# EAGLE design stm32103c8t6-v3 (EAGLE 7.3.0)
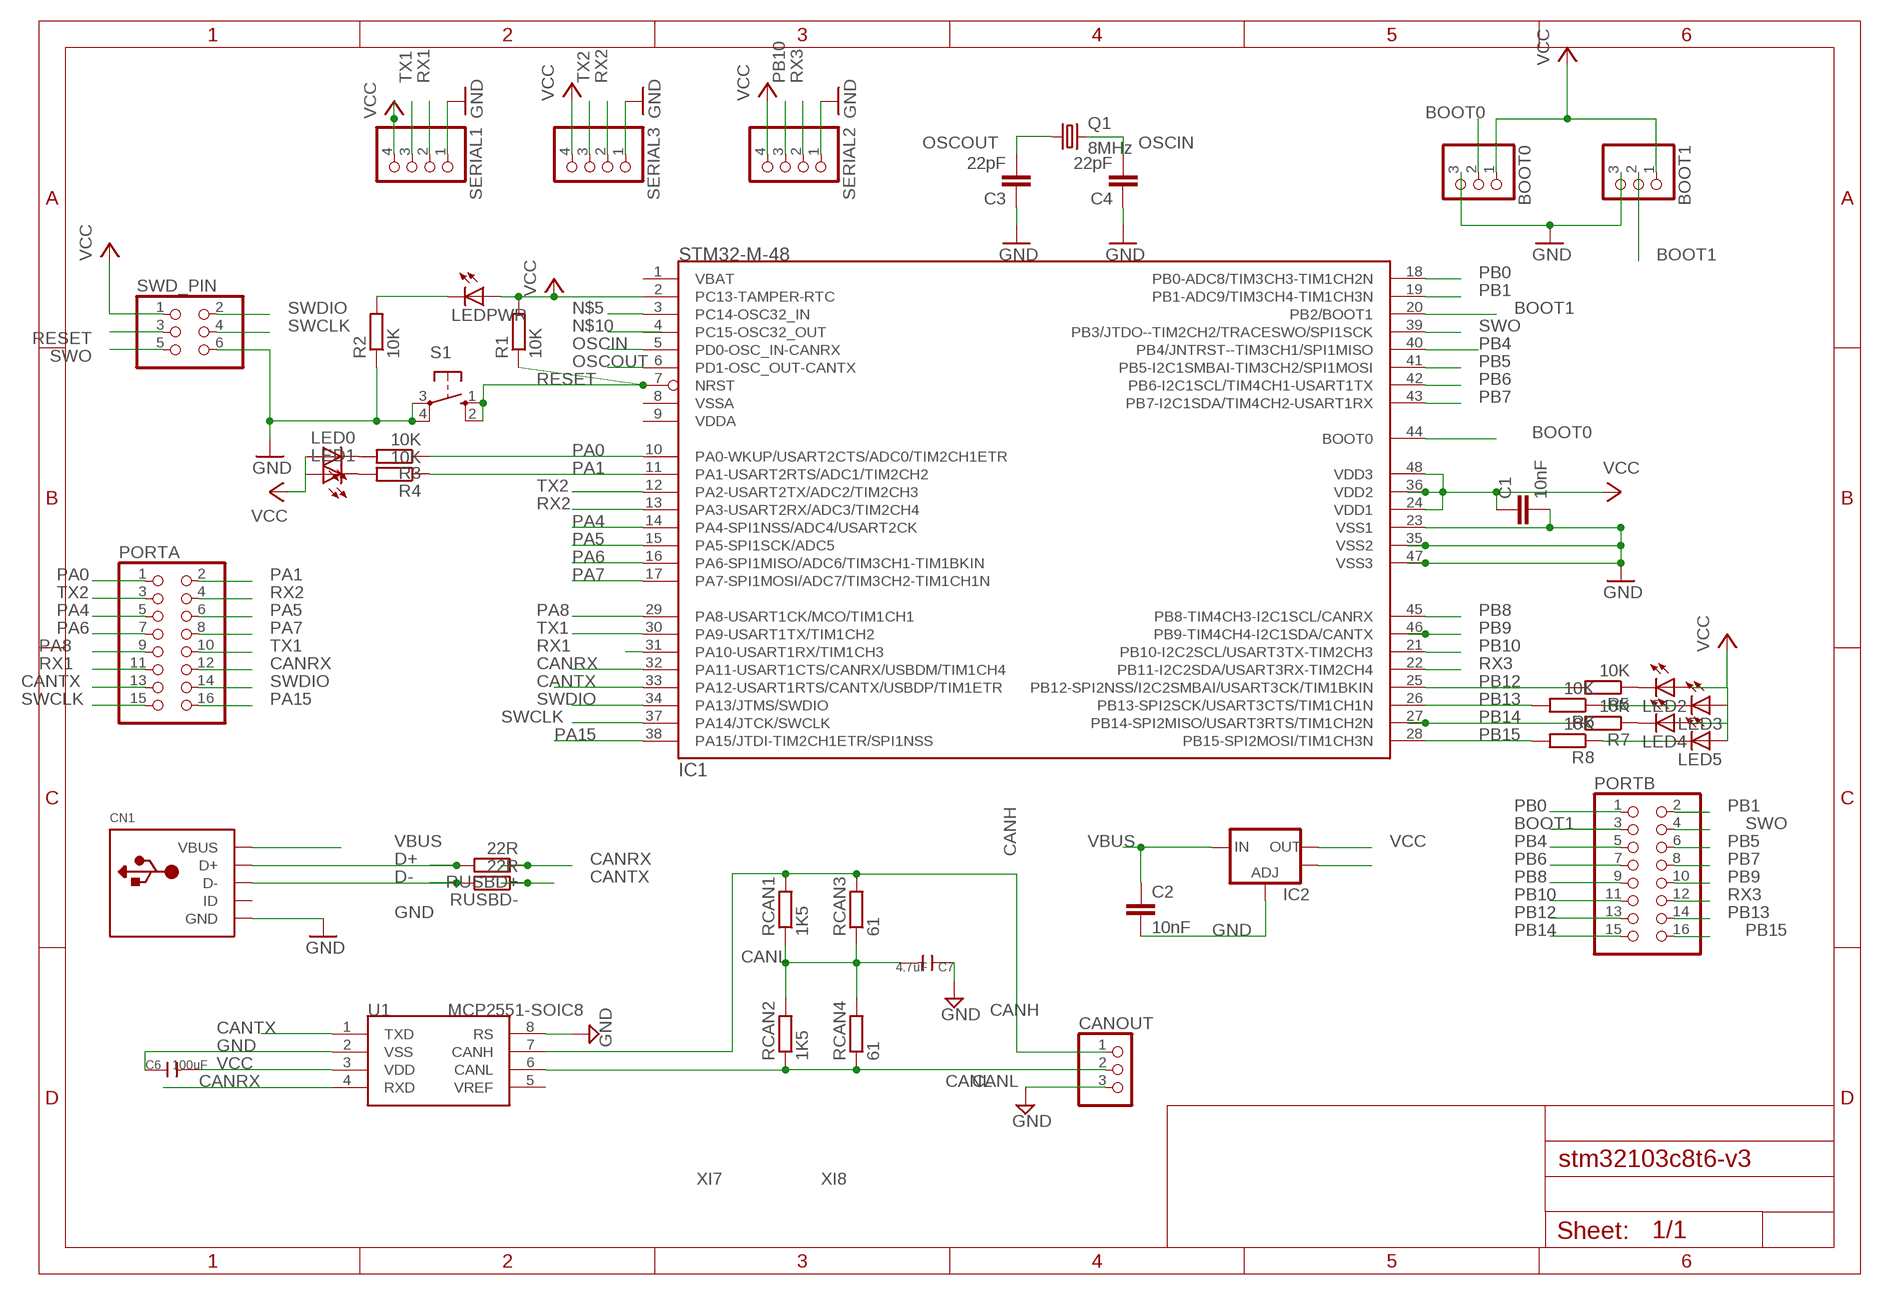
[diagram p0: schematic, sheet 1]

## Parts
BOOT0  PINHD-1X3  [1X03]
BOOT1  PINHD-1X3  [1X03]
C1  10nF  C-EUC1210  [C1210]
C2  10nF  C-EUC1206  [C1206]
C3  22pF  C-EUC1210  [C1210]
C4  22pF  C-EUC1210  [C1210]
C6  100uF  C-1206  [C1206]
C7  4.7uF  C-1206  [C1206]
CANOUT  PINHD-1X3  [1X03]
CN1  USBTHM  [USB-MINIB-THM]
IC1  STM32-M-48  [LQFP48]
IC2  V_REG_LM1117SOT223  [SOT223]
LED0  LEDSMT1206  [1206]
LED1  LEDSMT1206  [1206]
LED2  LEDSMT1206  [1206]
LED3  LEDSMT1206  [1206]
LED4  LEDSMT1206  [1206]
LED5  LEDSMT1206  [1206]
LEDPWR  LEDSMT1206  [1206]
PORTA  PINHD-2X8  [2X08]
PORTB  PINHD-2X8  [2X08]
Q1  8MHz  CRYSTALHC49S  [HC49/S]
R1  10K  R-EU_R1206  [R1206]
R2  10K  R-EU_R1206  [R1206]
R3  10K  R-EU_R1206  [R1206]
R4  10K  R-EU_R1206  [R1206]
R5  10K  R-EU_R1206  [R1206]
R6  10K  R-EU_R1206  [R1206]
R7  10K  R-EU_R1206  [R1206]
R8  10K  R-EU_R1206  [R1206]
RCAN1  1K5  R-EU_R1206  [R1206]
RCAN2  1K5  R-EU_R1206  [R1206]
RCAN3  61  R-EU_R1206  [R1206]
RCAN4  61  R-EU_R1206  [R1206]
RUSBD+  22R  R-EU_R1206  [R1206]
RUSBD-  22R  R-EU_R1206  [R1206]
S1  10-XX  [B3F-10XX]
SERIAL1  PINHD-1X4  [1X04]
SERIAL2  PINHD-1X4  [1X04]
SERIAL3  PINHD-1X4  [1X04]
SWD_PIN  PINHD-2X3  [2X03]
U1  MCP2551-SOIC8  [SOIC8-6.0]

## Nets
BOOT0: BOOT0.2 IC1.44(BOOT0)
BOOT1: BOOT1.2 IC1.20(PB2/BOOT1) PORTB.3
CANH [CAN]: CANOUT.1 RCAN1.2 RCAN3.2 U1.7(CANH)
CANL [CAN]: CANOUT.2 RCAN2.1 RCAN4.1 U1.6(CANL)
CANRX: IC1.32(PA11-USART1CTS/CANRX/USBDM/TIM1CH4) PORTA.12 RUSBD+.1 U1.4(RXD)
CANTX: IC1.33(PA12-USART1RTS/CANTX/USBDP/TIM1ETR) PORTA.13 RUSBD-.1 U1.1(TXD)
D+: CN1.D+ RUSBD+.2
D-: CN1.D- RUSBD-.2
GND [GND]: BOOT0.3 BOOT1.3 C1.2 C2.2 C3.1 C4.1 C6.1 C7.1 CANOUT.3 CN1.GND IC1.23(VSS1) IC1.35(VSS2) IC1.47(VSS3) IC2.1(ADJ) R2.1 S1.3(P) S1.4(P1) SERIAL1.1 SERIAL2.1 SERIAL3.1 SWD_PIN.6 U1.2(VSS) U1.8(RS)
N$1: IC2.4(OUT)
N$2: LED0.C R3.2
N$3: LED1.C R4.2
N$4: LEDPWR.C R2.2
N$5: IC1.3(PC14-OSC32_IN)
N$6: LED2.C R5.1
N$7: LED3.C R6.1
N$8: LED4.C R7.1
N$9: LED5.C R8.1
OSCIN: C4.2 IC1.5(PD0-OSC_IN-CANRX) Q1.2
OSCOUT: C3.2 IC1.6(PD1-OSC_OUT-CANTX) Q1.1
PA0: IC1.10(PA0-WKUP/USART2CTS/ADC0/TIM2CH1ETR) PORTA.1 R3.1
PA1: IC1.11(PA1-USART2RTS/ADC1/TIM2CH2) PORTA.2 R4.1
PA4: IC1.14(PA4-SPI1NSS/ADC4/USART2CK) PORTA.5
PA5: IC1.15(PA5-SPI1SCK/ADC5) PORTA.6
PA6: IC1.16(PA6-SPI1MISO/ADC6/TIM3CH1-TIM1BKIN) PORTA.7
PA7: IC1.17(PA7-SPI1MOSI/ADC7/TIM3CH2-TIM1CH1N) PORTA.8
PA8: IC1.29(PA8-USART1CK/MCO/TIM1CH1) PORTA.9
PA15: IC1.38(PA15/JTDI-TIM2CH1ETR/SPI1NSS) PORTA.16
PB0: IC1.18(PB0-ADC8/TIM3CH3-TIM1CH2N) PORTB.1
PB1: IC1.19(PB1-ADC9/TIM3CH4-TIM1CH3N) PORTB.2
PB4: IC1.40(PB4/JNTRST--TIM3CH1/SPI1MISO) PORTB.5
PB5: IC1.41(PB5-I2C1SMBAI-TIM3CH2/SPI1MOSI) PORTB.6
PB6: IC1.42(PB6-I2C1SCL/TIM4CH1-USART1TX) PORTB.7
PB7: IC1.43(PB7-I2C1SDA/TIM4CH2-USART1RX) PORTB.8
PB8: IC1.45(PB8-TIM4CH3-I2C1SCL/CANRX) PORTB.9
PB9: IC1.46(PB9-TIM4CH4-I2C1SDA/CANTX) PORTB.10
PB10: IC1.21(PB10-I2C2SCL/USART3TX-TIM2CH3) PORTB.11 SERIAL2.3
PB12: IC1.25(PB12-SPI2NSS/I2C2SMBAI/USART3CK/TIM1BKIN) PORTB.13 R5.2
PB13: IC1.26(PB13-SPI2SCK/USART3CTS/TIM1CH1N) PORTB.14 R6.2
PB14: IC1.27(PB14-SPI2MISO/USART3RTS/TIM1CH2N) PORTB.15 R7.2
PB15: IC1.28(PB15-SPI2MOSI/TIM1CH3N) PORTB.16 R8.2
RESET: IC1.7(NRST) R1.1 S1.1(S) S1.2(S1) SWD_PIN.3
RX1: IC1.31(PA10-USART1RX/TIM1CH3) PORTA.11 SERIAL1.2
RX2: IC1.13(PA3-USART2RX/ADC3/TIM2CH4) PORTA.4 SERIAL3.2
RX3: IC1.22(PB11-I2C2SDA/USART3RX-TIM2CH4) PORTB.12 SERIAL2.2
SWCLK: IC1.37(PA14/JTCK/SWCLK) PORTA.15 SWD_PIN.4
SWDIO: IC1.34(PA13/JTMS/SWDIO) PORTA.14 SWD_PIN.2
SWO: IC1.39(PB3/JTDO--TIM2CH2/TRACESWO/SPI1SCK) PORTB.4 SWD_PIN.5
TX1: IC1.30(PA9-USART1TX/TIM1CH2) PORTA.10 SERIAL1.3
TX2: IC1.12(PA2-USART2TX/ADC2/TIM2CH3) PORTA.3 SERIAL3.3
UNIC: C7.2 RCAN1.1 RCAN2.2 RCAN3.1 RCAN4.2
VBUS: C2.1 CN1.VBUS IC2.3(IN)
VCC [POWER]: BOOT0.1 BOOT1.1 C1.1 C6.2 IC1.2(PC13-TAMPER-RTC) IC1.24(VDD1) IC1.36(VDD2) IC1.48(VDD3) IC2.2(OUT) LED0.A LED1.A LED2.A LED3.A LED4.A LED5.A LEDPWR.A R1.2 SERIAL1.4 SERIAL2.4 SERIAL3.4 SWD_PIN.1 U1.3(VDD)
Unconnected: CN1.ID IC1.1(VBAT) IC1.4(PC15-OSC32_OUT) IC1.8(VSSA) IC1.9(VDDA) U1.5(VREF)

## Library data of the parts
BOOT0 BOOT1 CANOUT = pinhead:PINHD-1X3: PIN HEADER
C1-C4 = rcl:C-EU: CAPACITOR, European symbol
C6 C7 = Discrete:C*: Ceramic Capacitors
CN1 = adafruit:USB: USB Connectors USBMINIB - Surface Mount Female Mini-B USB Connector 4UConnector: 06564 By microbuilder.eu Thru-hole RA Female Mini-B USB Connector 4UConnector: 18732 By ladyada.net
IC1 = pel_stm32:STM32-M-48: STM32F103 Medium Density 48pins
IC2 = SparkFun-PowerIC:V_REG_LM1117: Voltage Regulator LM1117 Standard adjustable voltage regulator but in SMD form. Spark Fun Electronics SKU : COM-00595
LED0 LED1-LED5 LEDPWR = led:LED: LED OSRAM: - CHIPLED LG R971, LG N971, LY N971, LG Q971, LY Q971, LO R971, LY R971 LH N974, LH R974 LS Q976, LO Q976, LY Q976 LO Q996 - Hyper CHIPLED LW Q18S LB Q993, LB Q99A, LB R99A - SideLED LS A670, LO A670, LY A670, LG A670, LP A670 LB A673, LV A673, LT A673, LW A673 LH A674 LY A675 LS A676, LA A676, LO A676, LY A676, LW A676 LS A679, LY A679, LG A679 - Hyper Micro SIDELED® LS Y876, LA Y876, LO Y876, LY Y876 LT Y87S - SmartLED LW L88C, LW L88S LB L89C, LB L89S, LG L890 LS L89K, LO L89K, LY L89K LS L896, LA L896, LO L896, LY L896 - TOPLED LS T670, LO T670, LY T670, LG T670, LP T670 LSG T670, LSP T670, LSY T670, LOP T670, LYG T670 LG T671, LOG T671, LSG T671 LB T673, LV T673, LT T673, LW T673 LH T674 LS T676, LA T676, LO T676, LY T676, LB T676, LH T676, LSB T676, LW T676 LB T67C, LV T67C, LT T67C, LS T67K, LO T67K, LY T67K, LW E67C LS E67B, LA E67B, LO E67B, LY E67B, LB E67C, LV E67C, LT E67C LW T67C LS T679, LY T679, LG T679 LS T770, LO T770, LY T770, LG T770, LP T770 LB T773, LV T773, LT T773, LW T773 LH T774 LS E675, LA E675, LY E675, LS T675 LS T776, LA T776, LO T776, LY T776, LB T776 LHGB T686 LT T68C, LB T68C - Hyper Mini TOPLED® LB M676 - Mini TOPLED Santana® LG M470 LS M47K, LO M47K, LY M47K Source: http://www.osram.convergy.de LUXEON: - LUMILED® LXK2-PW12-R00, LXK2-PW12-S00, LXK2-PW14-U00, LXK2-PW14-V00 LXK2-PM12-R00, LXK2-PM12-S00, LXK2-PM14-U00 LXK2-PE12-Q00, LXK2-PE12-R00, LXK2-PE12-S00, LXK2-PE14-T00, LXK2-PE14-U00 LXK2-PB12-K00, LXK2-PB12-L00, LXK2-PB12-M00, LXK2-PB14-N00, LXK2-PB14-P00, LXK2-PB14-Q00 LXK2-PR12-L00, LXK2-PR12-M00, LXK2-PR14-Q00, LXK2-PR14-R00 LXK2-PD12-Q00, LXK2-PD12-R00, LXK2-PD12-S00 LXK2-PH12-R00, LXK2-PH12-S00 LXK2-PL12-P00, LXK2-PL12-Q00, LXK2-PL12-R00 Source: www.luxeon.com KINGBRIGHT: KA-3528ASYC Source: www.kingbright.com
PORTA PORTB = pinhead:PINHD-2X8: PIN HEADER
Q1 = crystal:CRYSTAL: CRYSTAL; OC_FARNELL: 1667008; OC_NEWARK: unknown
R1-R8 RCAN1-RCAN4 RUSBD+ RUSBD- = resistor:R-EU_: RESISTOR, European symbol
S1 = switch-omron:10-XX: OMRON SWITCH; MPN: B3F-1000; OC_FARNELL: 176432; OC_NEWARK: 36M3542
SERIAL1-SERIAL3 = pinhead:PINHD-1X4: PIN HEADER
SWD_PIN = pinhead:PINHD-2X3: PIN HEADER
U1 = IC:MCP2551: High-Speed CAN Transceiver http://ww1.microchip.com/downloads/en/devicedoc/21667f.pdf

## Net classes
3 CAN: width 0.356 mm

## Board
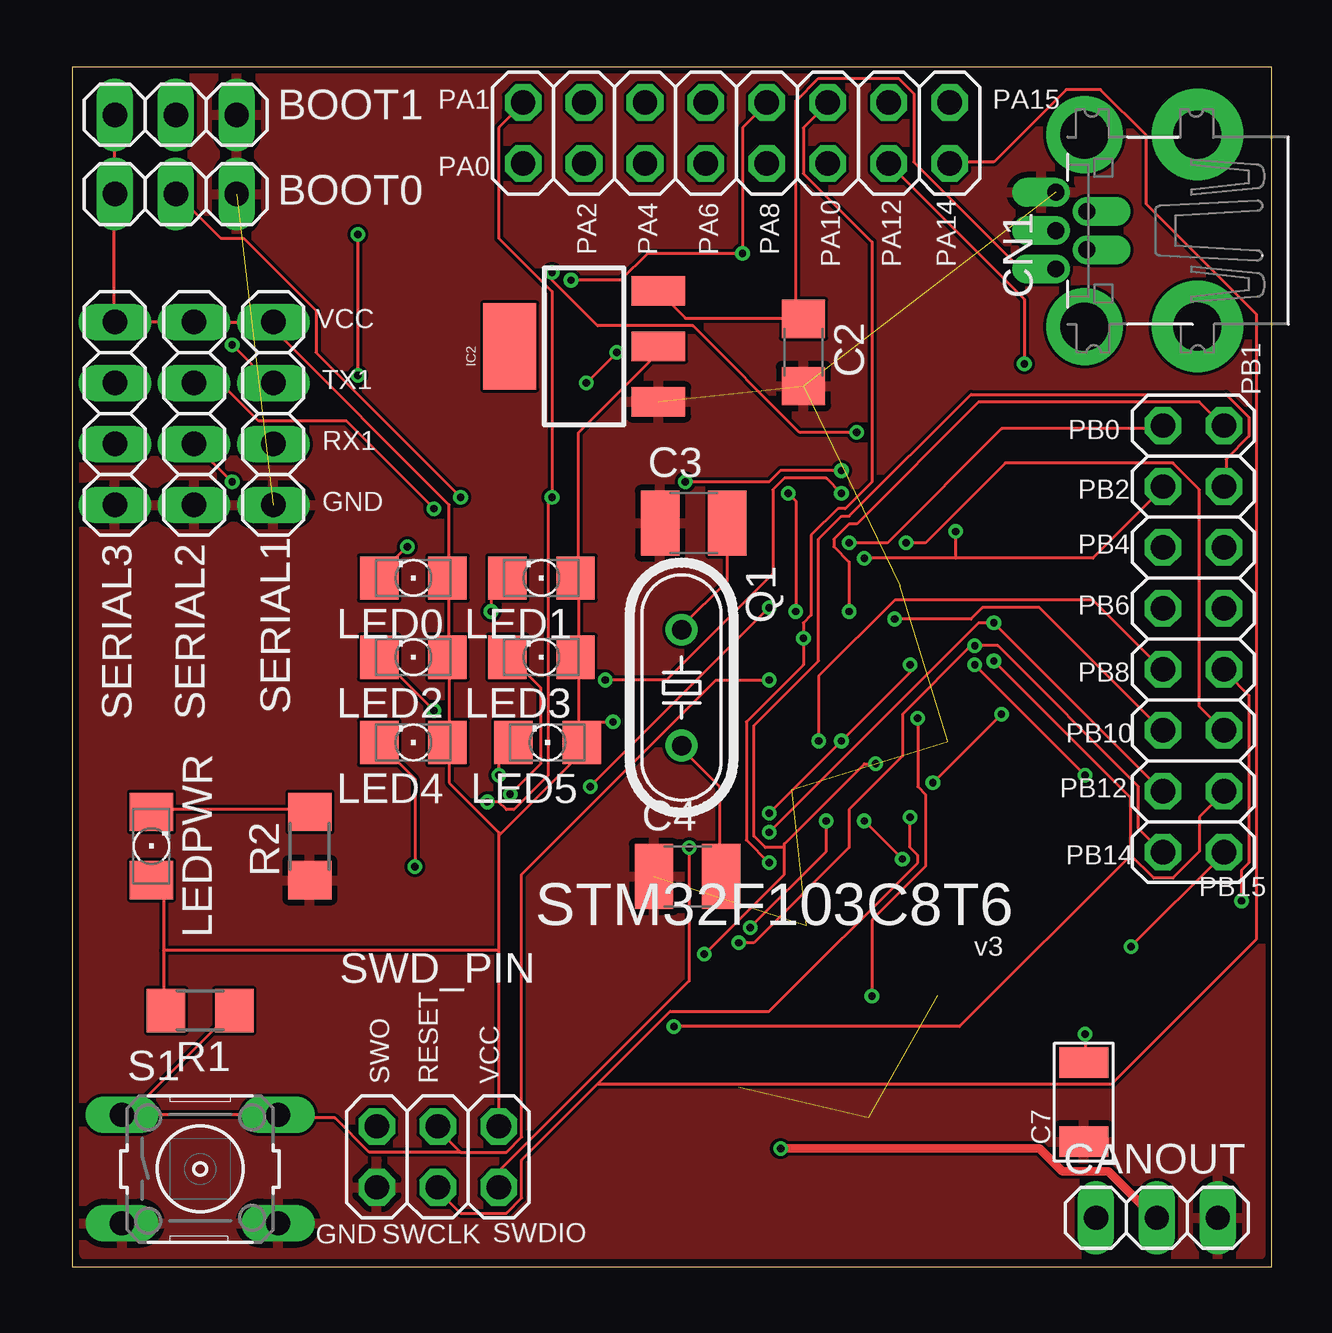
[diagram p1: board, top side]
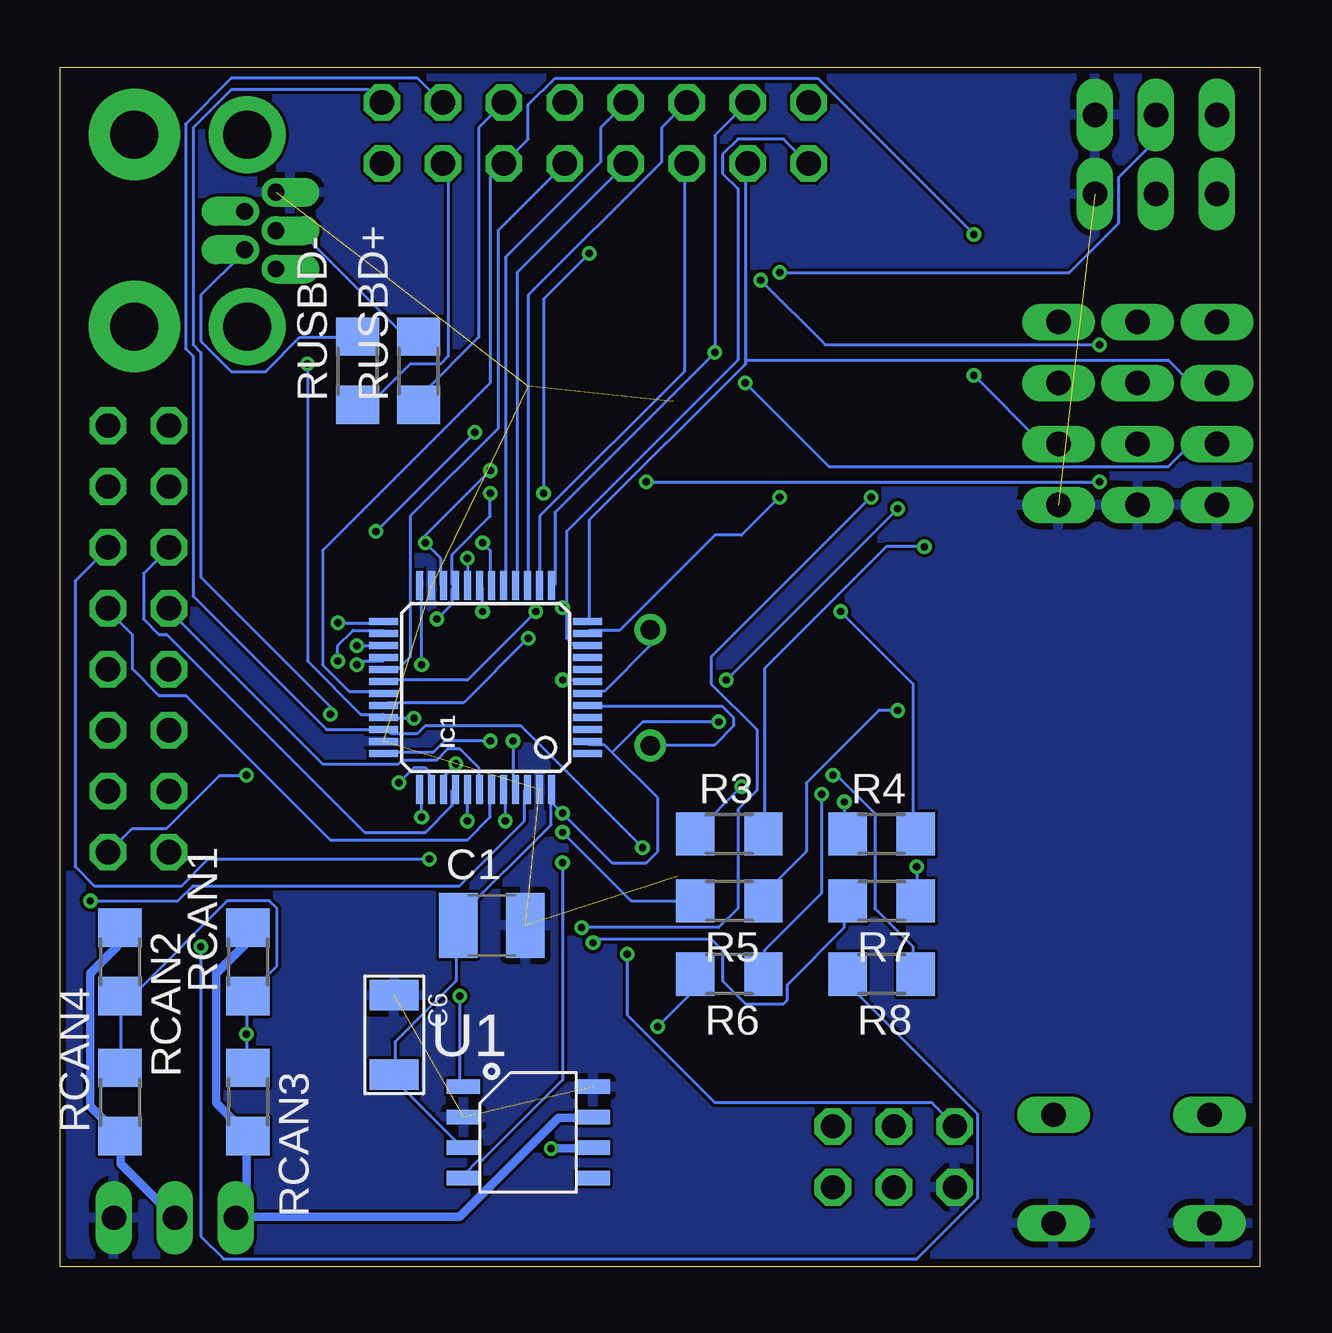
[diagram p2: board, bottom side, seen from below]

Size 50 x 50 mm. Coordinates in mm from the lower left corner, seen from the top.
Outline: 0,0 50,0 50,50 0,50 0,0
Copper layers (1*16): Top 0.035mm / dielectric 1.5mm / Bottom 0.035mm
Design rules "dirt_cheap_dirty_boards.v1": minimum track width 5mil, minimum drill 12mil, track to track 5mil, track to pad 5mil, pad to pad 5mil, via to via 5mil, smd to smd 0mil, copper to edge 10mil, drill to drill 10mil, minimum pad ring 10mil, minimum via ring 6mil, stop-mask expansion 2mil, vias tented up to drill 25mil, thermal gap 10mil

### Footprints (pad centres in the part's own frame; a part is rotated, then mirrored left to right if it is on the bottom)
1X03 = drill 1.016 long: 1 -2.54,0; 2 0,0; 3 2.54,0
C1210 = smd 1.6 x 2.7: 1 -1.4,0; 2 1.4,0
C1206 = smd 1.6 x 1.8: 1 -1.4,0; 2 1.4,0
C1206' = smd 1.27 x 2.032: 1 -1.651,0; 2 1.651,0
USB-MINIB-THM = drill 0.7 offset: D+ 0,9.8; D- -0.8,8.5; GND 1.6,9.8; ID 0.8,8.5; VBUS -1.6,9.8 | drill 2 pad 3.81: GND1 -4,3.9; GND4 4,3.9 | drill 2 pad 3.2: GND2 -4,8.6; GND3 4,8.6
LQFP48 = smd 0.3 x 1.2: 1 -2.75,-4.25; 2 -2.25,-4.25; 3 -1.75,-4.25; 4 -1.25,-4.25; 5 -0.75,-4.25; 6 -0.25,-4.25; 7 0.25,-4.25; 8 0.75,-4.25; 9 1.25,-4.25; 10 1.75,-4.25; 11 2.25,-4.25; 12 2.75,-4.25; 25 2.75,4.25; 26 2.25,4.25; 27 1.75,4.25; 28 1.25,4.25; 29 0.75,4.25; 30 0.25,4.25; 31 -0.25,4.25; 32 -0.75,4.25; 33 -1.25,4.25; 34 -1.75,4.25; 35 -2.25,4.25; 36 -2.75,4.25 | smd 1.2 x 0.3: 13 4.25,-2.75; 14 4.25,-2.25; 15 4.25,-1.75; 16 4.25,-1.25; 17 4.25,-0.75; 18 4.25,-0.25; 19 4.25,0.25; 20 4.25,0.75; 21 4.25,1.25; 22 4.25,1.75; 23 4.25,2.25; 24 4.25,2.75; 37 -4.25,2.75; 38 -4.25,2.25; 39 -4.25,1.75; 40 -4.25,1.25; 41 -4.25,0.75; 42 -4.25,0.25; 43 -4.25,-0.25; 44 -4.25,-0.75; 45 -4.25,-1.25; 46 -4.25,-1.75; 47 -4.25,-2.25; 48 -4.25,-2.75
SOT223 = smd 1.219 x 2.235: 1 -2.311,-3.099; 2 0,-3.099; 3 2.311,-3.099 | smd 3.6 x 2.2: 4 0,3.099
1206 = smd 1.6 x 1.803: A -1.422,0; C 1.422,0
2X08 = drill 1.016 octagon: 1 -8.89,-1.27; 2 -8.89,1.27; 3 -6.35,-1.27; 4 -6.35,1.27; 5 -3.81,-1.27; 6 -3.81,1.27; 7 -1.27,-1.27; 8 -1.27,1.27; 9 1.27,-1.27; 10 1.27,1.27; 11 3.81,-1.27; 12 3.81,1.27; 13 6.35,-1.27; 14 6.35,1.27; 15 8.89,-1.27; 16 8.89,1.27
HC49/S = drill 0.813: 1 -2.413,0; 2 2.413,0
R1206 = smd 1.6 x 1.803: 1 -1.422,0; 2 1.422,0
B3F-10XX = drill 1.016 long: 1 -3.251,2.261; 2 3.251,2.261; 3 -3.251,-2.261; 4 3.251,-2.261
1X04 = drill 1.016 long: 1 -3.81,0; 2 -1.27,0; 3 1.27,0; 4 3.81,0
2X03 = drill 1.016 octagon: 1 -2.54,-1.27; 2 -2.54,1.27; 3 0,-1.27; 4 0,1.27; 5 2.54,-1.27; 6 2.54,1.27
SOIC8-6.0 = smd 0.6 x 1.4: 1 -1.905,-2.7; 2 -0.635,-2.7; 3 0.635,-2.7; 4 1.905,-2.7; 5 1.905,2.7; 6 0.635,2.7; 7 -0.635,2.7; 8 -1.905,2.7

### Placement (x,y rotation side)
BOOT0  4.32,44.7 0 top
BOOT1  4.32,48.01 0 top
C1  32,14.22 0 bottom
C2  30.48,38.1 270 top
C3  25.91,30.99 0 top
C4  25.65,16.26 0 top
C6  100uF  [C1206']  36.07,9.65 270 bottom
C7  4.7uF  [C1206']  42.16,6.86 90 top
CANOUT  45.21,2.03 0 top
CN1  50.8,43.18 90 top
IC1  32.26,24.13 90 bottom
IC2  21.34,38.35 90 top
LED0  14.22,28.7 180 top
LED1  19.56,28.7 180 top
LED2  14.22,25.4 180 top
LED3  19.56,25.4 180 top
LED4  14.22,21.84 180 top
LED5  19.81,21.84 180 top
LEDPWR  3.3,17.53 90 top
PORTA  27.69,47.24 0 top
PORTB  46.74,26.16 270 top
Q1  25.4,24.13 270 top
R1  5.33,10.67 180 top
R2  9.91,17.53 90 top
R3  22.1,18.03 0 bottom
R4  15.75,18.03 0 bottom
R5  22.1,15.24 180 bottom
R6  22.1,12.19 180 bottom
R7  15.75,15.24 180 bottom
R8  15.75,12.19 180 bottom
RCAN1  42.16,12.7 90 bottom
RCAN2  47.5,12.7 270 bottom
RCAN3  42.16,6.86 270 bottom
RCAN4  47.5,6.86 90 bottom
RUSBD+  35.05,37.34 90 bottom
RUSBD-  37.59,37.34 90 bottom
S1  5.33,4.06 0 top
SERIAL1  8.38,35.56 90 top
SERIAL2  5.08,35.56 90 top
SERIAL3  1.78,35.56 90 top
SWD_PIN  15.24,4.57 180 top
U1  30.48,5.59 270 bottom

### Tracks (layer width: path | path; a pad name or v marks a point on that pad's centre or on a via)
BOOT0  (via drill 0.3)
  Top 0.127: v31.43,18.57 31.43,17.3 v28.26,14.13 | v16.19,32.07 10.16,38.1 10.16,39.85 7.14,42.86 6.19,42.86 4.45,44.61 BOOT0.2
  Bottom 0.127: v31.43,18.57 31.43,19.84 IC1.44 | v28.26,14.13 22.54,14.13 21.75,14.92 21.75,19.05 20.95,19.84 20.95,22.38 22.86,24.29 22.86,25.4 v16.19,32.07
BOOT1  (via drill 0.3)
  Top 0.127: 36.83,29.53 42.55,29.53 45.4,32.38 PORTB.3 | 36.83,29.53 v33.02,29.53 | v20,41.43 20,41.12 21.91,39.21 25.88,39.21 30.32,34.77 v32.7,34.77 | 36.83,29.53 v36.83,30.64
  Bottom 0.127: v33.02,29.53 33.02,28.42 IC1.20 | v20,41.43 7.94,41.43 5.87,43.5 5.87,45.4 4.45,46.83 4.45,47.94 BOOT1.2 | v36.83,30.64 v32.7,34.77
CANH
  Bottom 0.356: U1.7 27.78,6.19 29.21,6.19 33.34,2.06 42.55,2.06 CANOUT.1 42.23,2.22 42.23,5.4 RCAN3.2 42.23,5.56 43.5,6.83 43.5,12.22 42.23,13.49 42.23,13.97 RCAN1.2
CANL  (via drill 0.3)
  Top 0.356: v29.53,4.92 40.32,4.92 41.27,3.97 43.18,3.97 45.09,2.06 CANOUT.2
  Bottom 0.356: v29.53,4.92 27.78,4.92 U1.6 | CANOUT.2 47.47,4.29 47.47,5.4 RCAN4.1 47.62,5.56 48.74,6.67 48.74,12.22 47.62,13.34 47.62,13.97 RCAN2.1
CANRX  (via drill 0.3)
  Top 0.127: PORTA.12 31.43,48.42 30.48,47.47 30.48,45.56 33.34,42.7 33.34,32.7 32.23,31.59 31.91,31.59 30.8,30.48 30.8,27.15 30.48,26.83 v30.48,26.19 30.48,25.08 28.1,22.7 28.1,17.78 v29.05,16.83
  Bottom 0.127: v30.48,26.19 33.18,23.5 36.35,23.5 IC1.32 | v29.05,16.83 29.05,7.78 32.38,4.45 32.54,4.45 33.18,3.81 U1.4 | PORTA.12 32.54,47.47 32.54,38.73 34.92,36.35 34.92,36.04 RUSBD+.1
CANTX  (via drill 0.3)
  Top 0.127: v39.69,37.62 39.69,40.32 PORTA.13 | v33.34,11.27 33.34,14.45 35.56,16.67 35.56,19.68 35.24,20 v35.24,22.86
  Bottom 0.127: v39.69,37.62 39.69,25.24 37.47,23.02 36.51,23.02 IC1.33 36.35,22.86 v35.24,22.86 | v33.34,11.27 33.34,7.62 U1.1 | RUSBD-.1 37.47,36.04 36.99,36.04 35.4,37.62 34.13,37.62 33.81,37.94 33.81,45.72 33.97,45.88 PORTA.13
D+
  Bottom 0.127: CN1.D+ 40.01,43.18 35.72,38.89 35.08,38.89 RUSBD+.2
D-
  Bottom 0.127: RUSBD-.2 37.62,38.73 40.01,38.73 41.43,37.31 42.86,37.31 44.13,38.58 44.13,40.48 42.39,42.23 CN1.D-
GND  (10 unrouted)
  pour Bottom: 0.51,0.51 49.53,0.51 49.53,49.53 0.51,49.53
  pour Top: 0.51,0.51 0.51,49.53 49.53,49.53 49.53,0.51
N$2  (via drill 0.3)
  Top 0.127: v13.97,30 12.7,28.73 LED0.C
  Bottom 0.127: v13.97,30 15.56,30 20.64,24.92 20.64,18.1 R3.2
N$3  (via drill 0.3)
  Top 0.127: v17.46,27.3 17.46,27.94 18.1,28.57 LED1.C
  Bottom 0.127: v17.46,27.3 14.45,24.29 14.45,18.1 R4.2
N$4
  Top 0.127: LEDPWR.C 3.33,19.05 9.84,19.05 R2.2
N$6  (via drill 0.3)
  Top 0.127: v15.08,23.18 12.86,25.4 LED2.C
  Bottom 0.127: v15.08,23.18 15.88,23.18 18.89,20.16 18.89,17.3 20.64,15.56 20.64,15.24 R5.1
N$7  (via drill 0.3)
  Top 0.127: v18.26,19.68 19.53,20.95 19.53,24.13 18.26,25.4 LED3.C
  Bottom 0.127: v18.26,19.68 18.26,15.56 20.64,13.18 20.64,12.22 R6.1
N$8  (via drill 0.3)
  Top 0.127: v14.29,16.67 14.29,20.32 12.86,21.75 LED4.C
  Bottom 0.127: v14.29,16.67 14.29,15.24 R7.1
N$9  (via drill 0.3)
  Top 0.127: v17.78,20.48 17.78,21.27 18.26,21.75 LED5.C
  Bottom 0.127: v17.78,20.48 17.62,20.48 16.03,18.89 16.03,14.92 14.45,13.34 14.45,12.22 R8.1
OSCIN
  Top 0.127: C4.2 26.99,16.35 26.99,20 25.4,21.59 Q1.2
  Bottom 0.127: IC1.5 27.94,23.34 22.38,23.34 21.91,22.86 21.91,22.54 22.7,21.75 25.4,21.75 Q1.2
OSCOUT
  Top 0.127: C3.2 27.3,30.96 27.3,28.57 25.4,26.67 Q1.1
  Bottom 0.127: Q1.1 25.4,25.88 27.3,23.97 27.94,23.97 IC1.6
PA0  (via drill 0.3)
  Top 0.127: v29.05,27.46 v21.59,20
  Bottom 0.127: 28.89,27.46 28.89,30.64 21.75,37.78 21.75,44.93 22.38,45.56 22.38,46.35 21.75,46.99 19.84,46.99 18.89,46.04 PORTA.1 | 28.89,27.46 28.89,26.19 28.57,25.88 28.1,25.88 IC1.10 | v21.59,20 23.5,18.1 R3.1 | 28.89,27.46 v29.05,27.46
PA1  (via drill 0.3)
  Top 0.127: PORTA.2 18.73,48.42 17.78,47.47 17.78,42.86 20,40.64 v20,32.07 19.84,31.91 19.84,20.48 18.41,19.05 18.1,19.05 17.78,19.37 v17.3,19.37
  Bottom 0.127: v20,32.07 21.59,30.48 22.7,30.48 26.67,26.51 27.94,26.51 IC1.11 | v17.3,19.37 17.3,18.1 R4.1
PA4
  Bottom 0.127: IC1.14 30,28.42 30,31.27 23.97,37.31 23.97,45.88 PORTA.5
PA5
  Bottom 0.127: PORTA.6 24.92,47.47 24.92,46.04 30.48,40.48 30.48,28.42 IC1.15
PA6
  Bottom 0.127: PORTA.7 30.96,41.43 30.96,28.42 IC1.16
PA7
  Bottom 0.127: PORTA.8 27.46,47.47 27.46,46.04 31.43,42.07 31.43,28.42 IC1.17
PA8
  Bottom 0.127: PORTA.9 31.75,43.18 31.75,34.92 35.4,31.27 35.4,25.4 35.88,24.92 36.35,24.92 IC1.29
PA15  (via drill 0.3)
  Top 0.127: v38.73,23.02 v35.88,20.16
  Bottom 0.127: v35.88,20.16 35.24,20.8 34.77,20.8 34.61,20.64 34.61,20 IC1.38 | v38.73,23.02 38.73,23.34 44.13,28.73 44.13,38.1 44.45,38.42 44.45,47.47 42.86,49.05 37.15,49.05 36.67,48.58 PORTA.16
PB0  (via drill 0.3)
  Top 0.127: v32.38,30.16 33.97,30.16 38.73,34.92 45.4,34.92 PORTB.1
  Bottom 0.127: v32.38,30.16 32.07,29.84 32.07,28.42 IC1.18
PB1  (via drill 0.3)
  Top 0.127: v32.38,27.3 32.38,29.37 31.75,30 31.75,30.32 32.38,30.96 32.7,30.96 37.78,36.04 46.99,36.04 47.94,35.08 PORTB.2
  Bottom 0.127: v32.38,27.3 32.38,28.26 IC1.19
PB4
  Bottom 0.127: IC1.40 33.66,19.84 33.66,19.21 34.77,18.1 37.31,18.1 45.56,26.35 45.88,26.35 46.51,26.99 46.51,28.89 45.56,29.84 PORTB.5
PB5  (via drill 0.3)
  Top 0.127: v34.61,16.99 v33.02,18.57
  Bottom 0.127: v33.02,18.57 33.02,19.84 IC1.41 | v34.61,16.99 43.81,16.99 44.93,15.88 48.58,15.88 49.37,16.67 49.37,28.57 48.1,29.84 PORTB.6
PB6
  Bottom 0.127: IC1.42 32.54,20 32.54,20.8 33.34,21.59 33.81,21.59 34.29,21.11 35.72,21.11 35.88,20.95 39.05,20.95 45.4,27.3 PORTB.7
PB7
  Bottom 0.127: IC1.43 32.07,19.84 32.07,18.73 33.02,17.78 38.73,17.78 44.77,23.81 45.88,23.81 46.99,24.92 46.99,26.35 47.94,27.3 PORTB.8
PB8  (via drill 0.3)
  Top 0.127: v31.11,21.91 31.11,24.61 34.29,27.78 42.55,27.78 45.4,24.92 PORTB.9
  Bottom 0.127: v31.11,21.91 31.11,20 IC1.45
PB9  (via drill 0.3)
  Top 0.127: v48.74,15.24 48.74,16.51 49.05,16.83 49.05,23.81 48.1,24.77 PORTB.10
  Bottom 0.127: v48.74,15.24 45.09,15.24 44.45,15.88 33.34,15.88 30.64,18.57 30.64,19.84 IC1.46
PB10  (via drill 0.3)
  Top 0.127: v34.29,26.99 37.47,26.99 37.94,27.46 40.32,27.46 45.4,22.38 PORTB.11 | SERIAL2.3 6.19,36.83 7.78,35.24 11.43,35.24 v15.08,31.59 | v22.23,24.45 24.77,24.45 29.21,28.89 29.21,32.38 29.69,32.86 31.43,32.86 v32.07,32.23
  Bottom 0.127: v34.29,26.99 33.66,27.62 33.66,28.26 IC1.21 33.66,28.42 33.66,29.69 32.07,31.27 v32.07,32.23 | v22.23,24.45 v15.08,31.59
PB12  (via drill 0.3)
  Top 0.127: PORTB.13 45.4,19.84 v38.42,26.83 37.78,26.83 v29.05,18.1
  Bottom 0.127: v38.42,26.83 36.51,26.83 IC1.25 | R5.2 26.19,15.24 v29.05,18.1
PB13  (via drill 0.3)
  Top 0.127: v38.42,25.24 44.13,19.53 44.13,17.14 | 44.13,17.14 45.09,16.19 45.88,16.19 46.99,17.3 46.99,18.73 47.94,19.68 PORTB.14 | v25.08,10 36.99,10 44.13,17.14
  Bottom 0.127: v38.42,25.24 38.42,25.88 37.78,26.51 36.51,26.51 IC1.26 | v25.08,10 23.65,11.43 23.65,12.06 R6.2
PB14  (via drill 0.3)
  Top 0.127: PORTB.15 45.4,17.3 44.45,18.26 44.45,20 38.58,25.88 v37.62,25.88 37.47,25.88 34.61,23.02 34.61,21.27 32.38,19.05 32.38,17.46 28.42,13.49 v27.78,13.49
  Bottom 0.127: v37.62,25.88 IC1.27 | v27.78,13.49 27.62,13.65 22.86,13.65 22.38,13.18 22.38,11.91 21.43,10.95 19.84,10.95 19.68,11.11 19.68,11.75 17.3,14.13 17.3,15.24 R7.2
PB15  (via drill 0.3)
  Top 0.127: v42.23,20.48 v37.62,25.08 | v44.13,13.34 47.94,17.14 PORTB.16
  Bottom 0.127: v37.62,25.08 37.47,25.24 36.51,25.24 IC1.28 | v42.23,20.48 43.34,20.48 45.56,18.26 46.99,18.26 47.94,17.3 PORTB.16 | v44.13,13.34 44.13,1.27 43.18,0.32 14.29,0.32 11.75,2.86 11.75,6.35 17.14,11.75 17.14,12.06 R8.2
RESET  (via drill 0.3)
  Top 0.127: 2.38,6.35 2.22,6.19 S1.1 2.38,6.35 | 2.38,6.35 6.67,10.64 R1.1 | 2.38,6.35 8.57,6.35 S1.2 8.73,6.19 10.95,6.19 12.38,4.76 16.19,4.76 | v29.05,24.45 26.83,24.45 18.73,16.35 18.73,5.4 18.1,4.76 16.19,4.76 | 16.19,4.76 15.24,5.71 SWD_PIN.3
  Bottom 0.127: v29.05,24.45 28.1,24.45 IC1.7
RX1  (via drill 0.3)
  Top 0.127: v11.91,43.02 v11.91,37.15
  Bottom 0.127: IC1.31 36.51,23.97 37.94,23.97 39.05,25.08 39.05,29.84 32.07,36.83 32.07,45.4 PORTA.11 30.48,46.99 30.48,48.42 29.37,49.53 18.41,49.53 v11.91,43.02 | SERIAL1.2 9.05,34.29 v11.91,37.15
RX2  (via drill 0.3)
  Top 0.127: v22.7,38.1 v21.43,36.83
  Bottom 0.127: PORTA.4 22.7,47.15 v22.7,38.1 29.37,31.43 29.37,28.42 IC1.13 | SERIAL3.2 2.86,34.29 3.81,33.34 17.94,33.34 v21.43,36.83
RX3  (via drill 0.3)
  Top 0.127: v34.77,30.16 35.56,30.16 38.89,33.5 45.88,33.5 46.99,32.38 46.99,23.34 47.94,22.38 PORTB.12 | v6.67,32.7 SERIAL2.2 | v25.56,32.7 29.05,32.7 29.53,33.18 v32.07,33.18
  Bottom 0.127: IC1.22 34.13,28.42 34.13,29.53 v34.77,30.16 34.77,30.48 v32.07,33.18 | v25.56,32.7 v6.67,32.7
SWCLK  (via drill 0.3)
  Top 0.127: v34.92,18.73 34.92,17.46 35.24,17.14 35.24,16.83 29.05,10.64 24.92,10.64 21.91,7.62 | 21.91,7.62 18.73,4.45 18.73,2.86 18.1,2.22 16.19,2.22 15.24,3.17 SWD_PIN.4 | 21.91,7.62 43.34,7.62 49.37,13.65 49.37,39.69 44.77,44.29 44.77,47.15 42.86,49.05 41.43,49.05 38.42,46.04 36.67,46.04 PORTA.15
  Bottom 0.127: v34.92,18.73 34.92,19.84 IC1.37
SWDIO  (via drill 0.3)
  Top 0.127: SWD_PIN.2 17.78,3.97 25.72,11.91 v25.72,17.46
  Bottom 0.127: PORTA.14 34.13,48.58 35.08,49.53 42.86,49.53 44.77,47.62 44.77,38.26 44.45,37.94 44.45,27.94 38.89,22.38 IC1.34 36.35,22.38 36.2,22.23 35.08,22.23 34.77,22.54 30.8,22.54 v25.72,17.46
SWO  (via drill 0.3)
  Top 0.127: v33.5,20.95 33.02,20.95 29.69,17.62 29.69,17.46 | 29.69,17.46 29.69,16.35 v26.35,13.02 | 29.69,17.46 28.89,17.46 28.42,17.94 28.42,22.54 31.11,25.24 31.11,30.32 32.07,31.27 32.38,31.27 37.47,36.35 48.1,36.35 49.05,35.4 49.05,34.61 48.1,33.66 48.1,32.54 PORTB.4
  Bottom 0.127: v33.5,20.95 33.97,20.48 33.97,20 IC1.39 | v26.35,13.02 26.35,10.48 22.7,6.83 13.65,6.83 12.7,5.87 SWD_PIN.5
TX1  (via drill 0.3)
  Top 0.127: v30.16,27.3 30.16,31.91 v29.84,32.23 | PORTA.10 28.89,48.42 27.94,47.47 v27.94,42.23 23.97,42.23 22.86,41.12 v20.8,41.12 | v6.67,38.42 8.26,36.83 SERIAL1.3
  Bottom 0.127: v30.16,27.3 33.02,24.45 36.35,24.45 IC1.30 | v29.84,32.23 29.84,40.32 v27.94,42.23 | v6.67,38.42 18.1,38.42 v20.8,41.12
TX2
  Bottom 0.127: 21.43,37.78 21.43,45.88 PORTA.3 | 21.43,37.78 21.43,37.62 27.94,31.11 27.94,26.99 IC1.12 | SERIAL3.3 2.86,36.83 3.81,37.78 21.43,37.78
UNIC  (via drill 0.3)
  Top 0.127: v42.23,9.68 42.23,8.57 C7.2
  Bottom 0.127: RCAN4.2 47.47,8.41 47.47,11.27 RCAN2.2 47.47,11.43 46.83,11.43 43.02,15.24 41.27,15.24 40.96,14.92 40.96,12.54 42.07,11.43 RCAN1.1 42.23,11.27 v42.23,9.68 42.23,8.41 RCAN3.1
VBUS
  Top 0.127: 30.16,39.53 25.56,39.53 24.45,40.64 IC2.3 | 30.16,39.53 30.48,39.53 C2.1 30.16,39.53 | 30.16,39.53 30.16,48.58 31.11,49.53 34.45,49.53 35.08,48.9 35.08,46.04 39.53,41.59 40.96,41.59 CN1.VBUS
VCC  (via drill 0.3)
  Top 0.127: v29.05,18.89 v32.07,21.91 34.92,24.77 v34.92,25.08 | 21.11,25.4 21.11,28.57 LED1.A 21.11,28.73 21.11,34.77 24.29,37.94 24.29,38.26 IC2.2 | 21.11,25.4 21.11,22.7 | 21.11,22.7 21.11,21.91 LED5.A | 21.11,25.4 LED3.A | BOOT1.1 1.75,47.94 1.75,44.77 BOOT0.1 1.75,44.61 1.75,39.37 SERIAL3.4 SERIAL2.4 SERIAL1.4 8.41,39.37 8.41,39.05 15.72,31.75 15.72,28.73 LED0.A 15.72,28.57 15.72,25.4 | 3.81,13.18 3.81,15.56 3.33,16.03 LEDPWR.A | 3.81,13.18 3.81,10.79 R1.2 | 15.72,25.4 15.72,21.91 LED4.A 15.72,21.75 15.72,20.16 17.78,18.1 17.78,17.94 | 15.72,25.4 LED2.A | 17.78,17.94 17.78,13.18 | 17.78,13.18 SWD_PIN.1 | 17.78,13.18 3.81,13.18 | 17.78,17.94 21.11,21.27 21.11,21.75 LED5.A | 21.11,22.7 v22.54,22.7 | 21.11,22.7 LED5.A
  Bottom 0.127: U1.3 33.34,5.08 36.2,7.94 C6.2 36.04,8.1 36.04,9.37 33.5,11.91 33.5,14.13 C1.1 33.34,14.29 33.34,14.61 29.53,18.41 29.53,19.37 | 29.53,19.37 29.53,19.84 IC1.48 29.53,19.37 | 26.99,21.43 25.08,19.53 25.08,17.3 25.56,16.83 26.99,16.83 v29.05,18.89 29.53,19.37 | 26.99,21.43 27.3,21.75 27.94,21.75 IC1.2 | v32.07,21.91 33.97,21.91 34.45,21.43 36.35,21.43 IC1.36 | v34.92,25.08 34.92,28.26 IC1.24 | 26.99,21.43 25.72,22.7 v22.54,22.7

### Text on the board
tNames: PA1 | PA15 | PA0 | PA2 | PA4 | PA6 | PA8 | PA10 | PA12 | PA14 | VCC | TX1 | PB1 | PB0 | RX1 | PB2 | GND | PB4 | PB6 | PB8 | PB10 | PB12 | PB14 | PB15 | STM32F103C8T6 | v3 | SWO | RESET | VCC | GND | SWCLK | SWDIO